# Altium project FPC40PinConnectVer1.0.PrjPcb
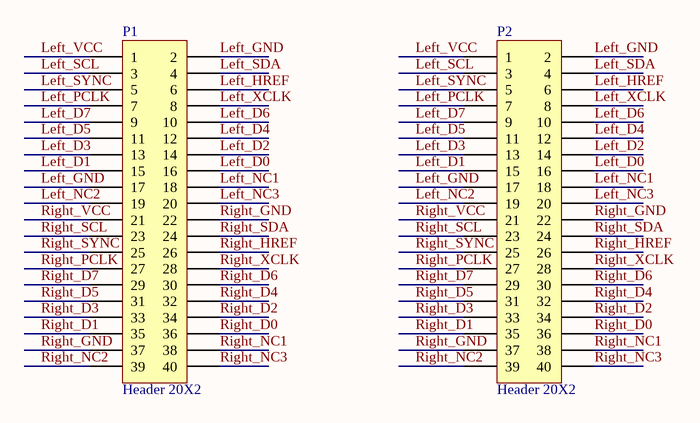
[diagram p0: Sheet1.SchDoc]
1 sheet, 2 parts. Net scope: global (net labels, ports and power ports of the same name join across sheets).
Board file: PCB1.PcbDoc

## Sheet Sheet1.SchDoc
size A4

### Parts
P1  Header 20X2  [FPC_40pin_05mm]
P2  Header 20X2  [FPC_40pin_05mm]

### Nets
Left_D0: P1.16 P2.16
Left_D1: P1.15 P2.15
Left_D2: P1.14 P2.14
Left_D3: P1.13 P2.13
Left_D4: P1.12 P2.12
Left_D5: P1.11 P2.11
Left_D6: P1.10 P2.10
Left_D7: P1.9 P2.9
Left_GND: P1.2 P1.17 P2.2 P2.17
Left_HREF: P1.6 P2.6
Left_NC1: P1.18 P2.18
Left_NC2: P1.19 P2.19
Left_NC3: P1.20 P2.20
Left_PCLK: P1.7 P2.7
Left_SCL: P1.3 P2.3
Left_SDA: P1.4 P2.4
Left_SYNC: P1.5 P2.5
Left_VCC: P1.1 P2.1
Left_XCLK: P1.8 P2.8
Right_D0: P1.36 P2.36
Right_D1: P1.35 P2.35
Right_D2: P1.34 P2.34
Right_D3: P1.33 P2.33
Right_D4: P1.32 P2.32
Right_D5: P1.31 P2.31
Right_D6: P1.30 P2.30
Right_D7: P1.29 P2.29
Right_GND: P1.22 P1.37 P2.22 P2.37
Right_HREF: P1.26 P2.26
Right_NC1: P1.38 P2.38
Right_NC2: P1.39 P2.39
Right_NC3: P1.40 P2.40
Right_PCLK: P1.27 P2.27
Right_SCL: P1.23 P2.23
Right_SDA: P1.24 P2.24
Right_SYNC: P1.25 P2.25
Right_VCC: P1.21 P2.21
Right_XCLK: P1.28 P2.28

### Library data of the parts
P1 P2 = Header 20X2: Header, 20-Pin, Dual row; LatestRevisionDate: 17-Jul-2002; LatestRevisionNote: Re-released for DXP Platform.; Publisher: Altium Limited